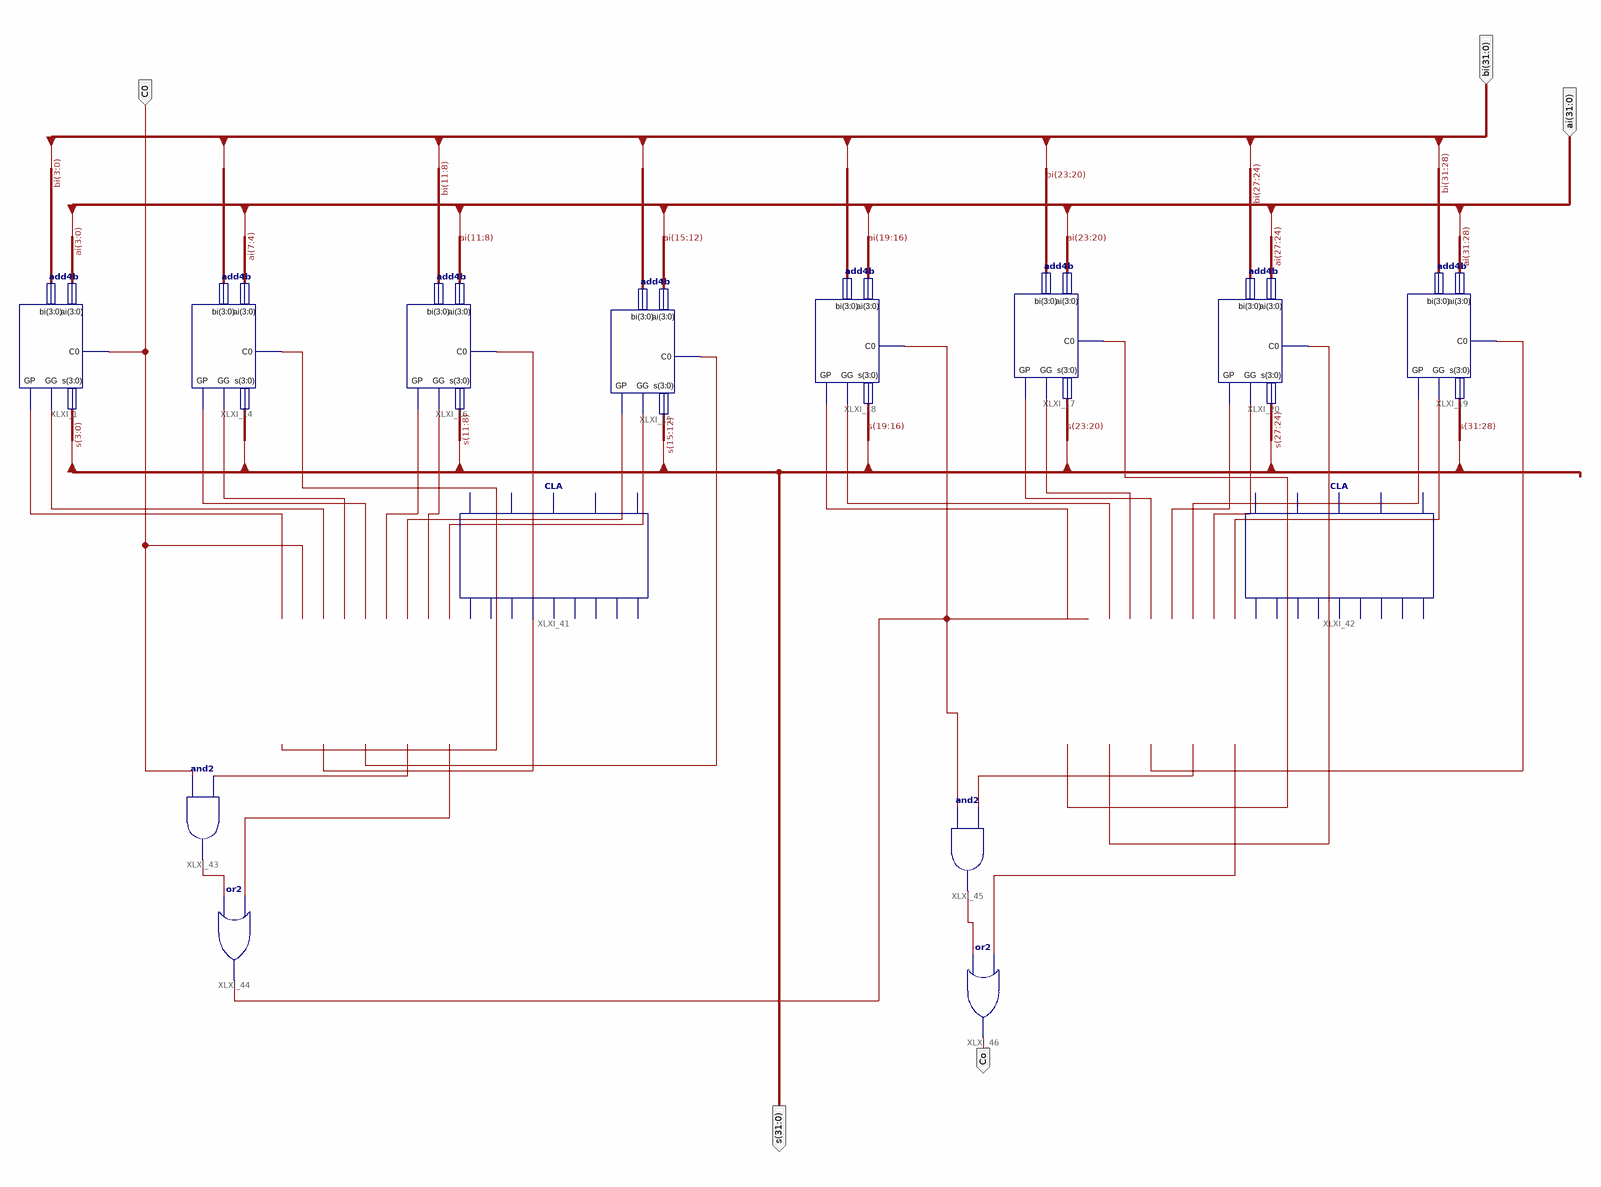
[diagram p0: schematic sheet 1]
// Xilinx ISE schematic ADC32.sch (kintex7) as structural Verilog: 14 symbols, 5 ports
module ADC32 (
  input  [31:0] ai,
  input  [31:0] bi,
  input  C0,
  output Co,
  output [31:0] s
);

  wire XLXN_33, XLXN_35, XLXN_36, XLXN_37, XLXN_38, XLXN_39, XLXN_40, XLXN_41, XLXN_42, XLXN_43, XLXN_44,
       XLXN_45, XLXN_46, XLXN_47, XLXN_48, XLXN_49, XLXN_50, XLXN_54, XLXN_55, XLXN_59, XLXN_60, XLXN_61,
       XLXN_66, XLXN_67, XLXN_68, XLXN_69, XLXN_70, XLXN_78, XLXN_79;

  add4b XLXI_14 (.ai(ai[7:4]), .bi(bi[7:4]), .s(s[7:4]), .GG(XLXN_37), .GP(XLXN_36), .C0(XLXN_79));
  add4b XLXI_1 (.ai(ai[3:0]), .bi(bi[3:0]), .s(s[3:0]), .GG(XLXN_35), .GP(XLXN_33), .C0(C0));
  add4b XLXI_16 (.ai(ai[11:8]), .bi(bi[11:8]), .s(s[11:8]), .GG(XLXN_40), .GP(XLXN_38), .C0(XLXN_59));
  add4b XLXI_15 (.ai(ai[15:12]), .bi(bi[15:12]), .s(s[15:12]), .GG(XLXN_41), .GP(XLXN_39), .C0(XLXN_60));
  add4b XLXI_18 (.ai(ai[19:16]), .bi(bi[19:16]), .s(s[19:16]), .GG(XLXN_43), .GP(XLXN_42), .C0(XLXN_61));
  add4b XLXI_17 (.ai(ai[23:20]), .bi(bi[23:20]), .s(s[23:20]), .GG(XLXN_45), .GP(XLXN_44), .C0(XLXN_66));
  add4b XLXI_20 (.ai(ai[27:24]), .bi(bi[27:24]), .s(s[27:24]), .GG(XLXN_47), .GP(XLXN_46), .C0(XLXN_67));
  add4b XLXI_19 (.ai(ai[31:28]), .bi(bi[31:28]), .s(s[31:28]), .GG(XLXN_49), .GP(XLXN_48), .C0(XLXN_68));
  CLA XLXI_41 (
    .P0(XLXN_33), .Ci(C0), .G0(XLXN_35), .G1(XLXN_37), .P1(XLXN_36), .P2(XLXN_38), .P3(XLXN_39),
    .G2(XLXN_40), .G3(XLXN_41), .C1(XLXN_79), .C2(XLXN_59), .C3(XLXN_60), .GP(XLXN_50), .GG(XLXN_54));
  CLA XLXI_42 (
    .P0(XLXN_42), .Ci(XLXN_61), .G0(XLXN_43), .G1(XLXN_45), .P1(XLXN_44), .P2(XLXN_46), .P3(XLXN_48),
    .G2(XLXN_47), .G3(XLXN_49), .C1(XLXN_66), .C2(XLXN_67), .C3(XLXN_68), .GP(XLXN_69), .GG(XLXN_78));
  and XLXI_43 (XLXN_55, C0, XLXN_50);
  or XLXI_44 (XLXN_61, XLXN_55, XLXN_54);
  and XLXI_45 (XLXN_70, XLXN_61, XLXN_69);
  or XLXI_46 (Co, XLXN_70, XLXN_78);
endmodule
